# Altium schematic sheet GARY_Backplane_ModuleSlot_CurrentBuffer.SchDoc
size A3
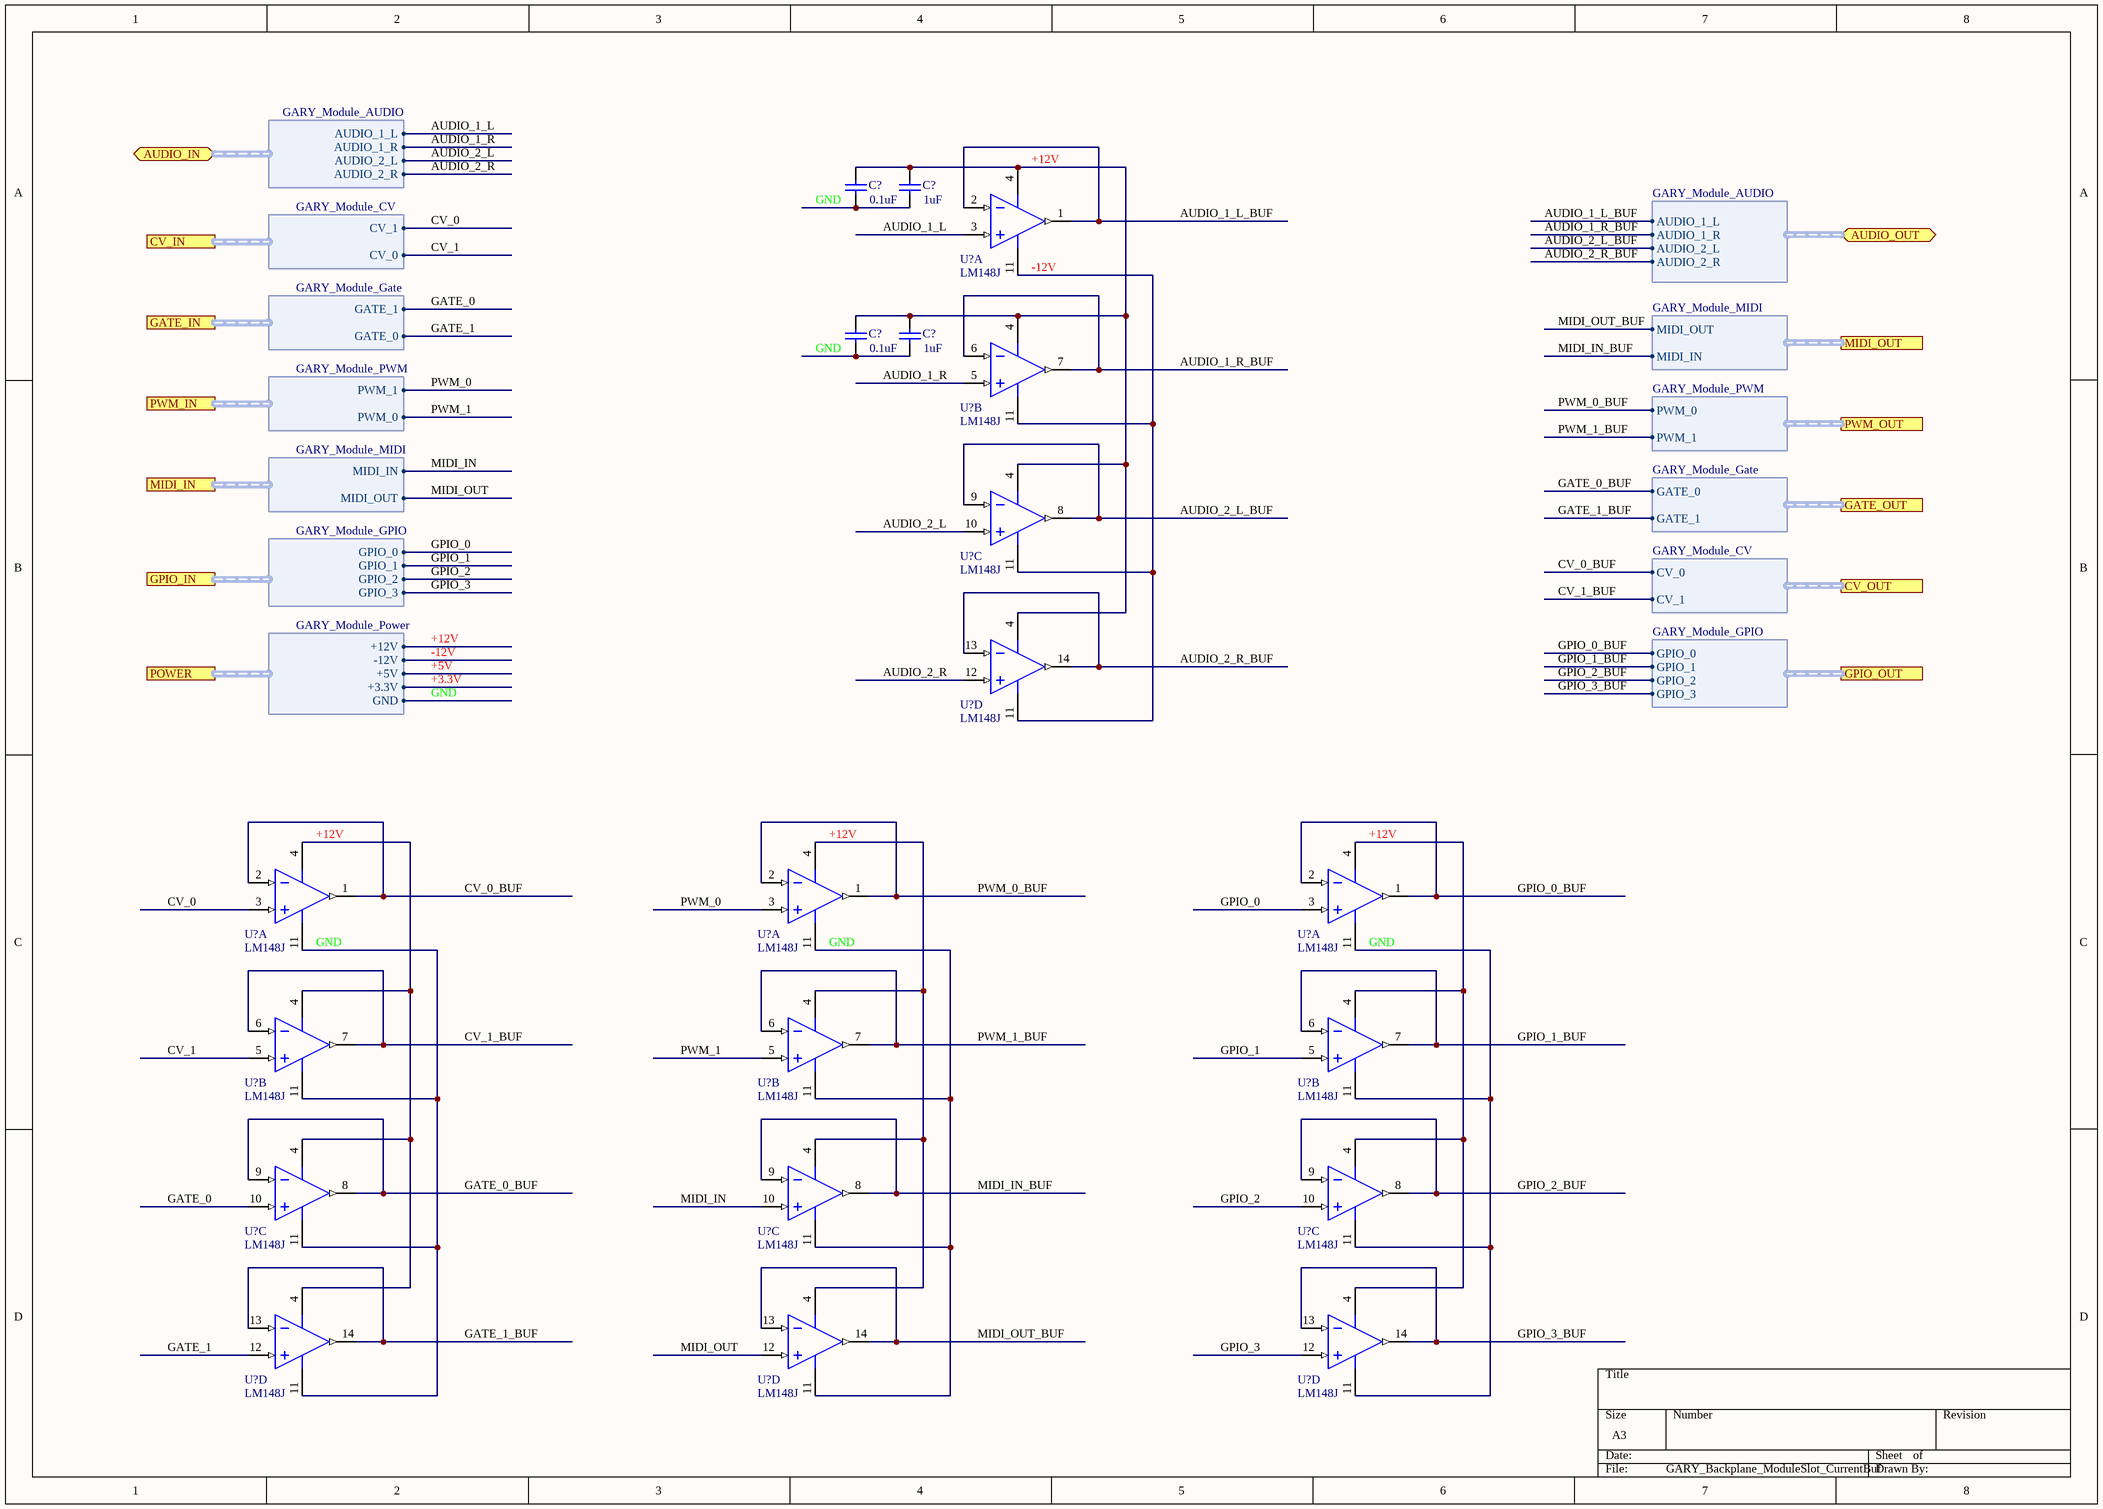
[diagram p0: GARY_Backplane_ModuleSlot_CurrentBuffer.SchDoc]

## Parts
(Parts that share a designator on the sheet are numbered #1, #2 ... from top to bottom, then left to right.)
C?#1  value 0.1uF  [RAD-0.3]  (hidden comment: Cap)
C?#2  value 1uF  [RAD-0.3]  (hidden comment: Cap)
C?#3  value 0.1uF  [RAD-0.3]  (hidden comment: Cap)
C?#4  value 1uF  [RAD-0.3]  (hidden comment: Cap)
U?#1  LM148J  [J14A]  (part A of 4)
U?#2  LM148J  [J14A]  (part B of 4)
U?#3  LM148J  [J14A]  (part C of 4)
U?#4  LM148J  [J14A]  (part D of 4)
U?#5  LM148J  [J14A]  (part A of 4)
U?#6  LM148J  [J14A]  (part A of 4)
U?#7  LM148J  [J14A]  (part A of 4)
U?#8  LM148J  [J14A]  (part B of 4)
U?#9  LM148J  [J14A]  (part B of 4)
U?#10  LM148J  [J14A]  (part B of 4)
U?#11  LM148J  [J14A]  (part C of 4)
U?#12  LM148J  [J14A]  (part C of 4)
U?#13  LM148J  [J14A]  (part C of 4)
U?#14  LM148J  [J14A]  (part D of 4)
U?#15  LM148J  [J14A]  (part D of 4)
U?#16  LM148J  [J14A]  (part D of 4)

## Ports
AUDIO_IN (harness GARY_Module_AUDIO), AUDIO_OUT (harness GARY_Module_AUDIO), CV_IN (harness GARY_Module_CV), CV_OUT (harness GARY_Module_CV), GATE_IN (harness GARY_Module_Gate), GATE_OUT (harness GARY_Module_Gate), GPIO_IN (harness GARY_Module_GPIO), GPIO_OUT (harness GARY_Module_GPIO), MIDI_IN (harness GARY_Module_MIDI), MIDI_OUT (harness GARY_Module_MIDI), POWER (harness GARY_Module_Power), PWM_IN (harness GARY_Module_PWM), PWM_OUT (harness GARY_Module_PWM)

## Harnesses
GARY_Module_Power: +12V, +5V, GND, +3.3V, -12V
GARY_Module_MIDI: MIDI_IN, MIDI_OUT
GARY_Module_GPIO: GPIO_0, GPIO_1, GPIO_2, GPIO_3
GARY_Module_PWM: PWM_0, PWM_1
GARY_Module_CV: CV_0, CV_1
GARY_Module_Gate: GATE_0, GATE_1
GARY_Module_AUDIO: AUDIO_1_L, AUDIO_1_R, AUDIO_2_R, AUDIO_2_L

## Nets
+3.3V: port POWER.+3.3V
+5V: port POWER.+5V
+12V: C?#1.2 C?#2.2 C?#3.2 C?#4.2 U?#1.4(V+) U?#2.4(V+) U?#3.4(V+) U?#4.4(V+) U?#5.4(V+) U?#6.4(V+) U?#7.4(V+) U?#8.4(V+) U?#9.4(V+) U?#10.4(V+) U?#11.4(V+) U?#12.4(V+) U?#13.4(V+) U?#14.4(V+) U?#15.4(V+) U?#16.4(V+) ; port POWER.+12V
-12V: U?#1.11(V-) U?#2.11(V-) U?#3.11(V-) U?#4.11(V-) ; port POWER.-12V
AUDIO_1_L: U?#1.3(IN1+) ; port AUDIO_IN.AUDIO_1_L
AUDIO_1_L_BUF: U?#1.1(OUT1) U?#1.2(IN1-) ; port AUDIO_OUT.AUDIO_1_L
AUDIO_1_R: U?#2.5(IN2+) ; port AUDIO_IN.AUDIO_1_R
AUDIO_1_R_BUF: U?#2.6(IN2-) U?#2.7(OUT2) ; port AUDIO_OUT.AUDIO_1_R
AUDIO_2_L: U?#3.10(IN3+) ; port AUDIO_IN.AUDIO_2_L
AUDIO_2_L_BUF: U?#3.8(OUT3) U?#3.9(IN3-) ; port AUDIO_OUT.AUDIO_2_L
AUDIO_2_R: U?#4.12(IN4+) ; port AUDIO_IN.AUDIO_2_R
AUDIO_2_R_BUF: U?#4.13(IN4-) U?#4.14(OUT4) ; port AUDIO_OUT.AUDIO_2_R
CV_0: U?#5.3(IN1+) ; port CV_IN.CV_1
CV_0_BUF: U?#5.1(OUT1) U?#5.2(IN1-) ; port CV_OUT.CV_0
CV_1: U?#8.5(IN2+) ; port CV_IN.CV_0
CV_1_BUF: U?#8.6(IN2-) U?#8.7(OUT2) ; port CV_OUT.CV_1
GATE_0: U?#11.10(IN3+) ; port GATE_IN.GATE_1
GATE_0_BUF: U?#11.8(OUT3) U?#11.9(IN3-) ; port GATE_OUT.GATE_0
GATE_1: U?#14.12(IN4+) ; port GATE_IN.GATE_0
GATE_1_BUF: U?#14.13(IN4-) U?#14.14(OUT4) ; port GATE_OUT.GATE_1
GND: C?#1.1 C?#2.1 C?#3.1 C?#4.1 U?#5.11(V-) U?#6.11(V-) U?#7.11(V-) U?#8.11(V-) U?#9.11(V-) U?#10.11(V-) U?#11.11(V-) U?#12.11(V-) U?#13.11(V-) U?#14.11(V-) U?#15.11(V-) U?#16.11(V-) ; port POWER.GND
GPIO_0: U?#7.3(IN1+) ; port GPIO_IN.GPIO_0
GPIO_0_BUF: U?#7.1(OUT1) U?#7.2(IN1-) ; port GPIO_OUT.GPIO_0
GPIO_1: U?#10.5(IN2+) ; port GPIO_IN.GPIO_1
GPIO_1_BUF: U?#10.6(IN2-) U?#10.7(OUT2) ; port GPIO_OUT.GPIO_1
GPIO_2: U?#13.10(IN3+) ; port GPIO_IN.GPIO_2
GPIO_2_BUF: U?#13.8(OUT3) U?#13.9(IN3-) ; port GPIO_OUT.GPIO_2
GPIO_3: U?#16.12(IN4+) ; port GPIO_IN.GPIO_3
GPIO_3_BUF: U?#16.13(IN4-) U?#16.14(OUT4) ; port GPIO_OUT.GPIO_3
MIDI_IN: U?#12.10(IN3+) ; port MIDI_IN.MIDI_IN
MIDI_IN_BUF: U?#12.8(OUT3) U?#12.9(IN3-) ; port MIDI_OUT.MIDI_IN
MIDI_OUT: U?#15.12(IN4+) ; port MIDI_IN.MIDI_OUT
MIDI_OUT_BUF: U?#15.13(IN4-) U?#15.14(OUT4) ; port MIDI_OUT.MIDI_OUT
PWM_0: U?#6.3(IN1+) ; port PWM_IN.PWM_1
PWM_0_BUF: U?#6.1(OUT1) U?#6.2(IN1-) ; port PWM_OUT.PWM_0
PWM_1: U?#9.5(IN2+) ; port PWM_IN.PWM_0
PWM_1_BUF: U?#9.6(IN2-) U?#9.7(OUT2) ; port PWM_OUT.PWM_1

## Library data of the parts
C?#1-C?#4 = Cap: Capacitor; Published: 8-Jun-2000; LatestRevisionDate: 17-Jul-2002; LatestRevisionNote: Re-released for DXP Platform.; PackageReference: RAD-0.3; Publisher: Altium Limited; PackageDescription: Radial Cap, Thru-Hole; 2 Leads; 0.3 in Pin Spacing
U?#1-U?#16 = LM148J: Series Quad 741 Op Amp, 14-pin CerDIP; Manufacturer: National Semiconductor; PackageTopMarking: NSUZXYYTT*LM148J; PowerWise: N; CompType: Amplifiers; High-Reliability: Y; DatasheetVersion: Nov-2003; PackageVersion: revJ, Jul-2002; PackageReference: J14A; PackageDescription: Cerdip, .400 x .310in Body, 14 Lead, .300in Centers, .100in Pitch; PartNumber: LM148J; RoHS: N; PinCount: 14; ComponentLink1Description: Manufacturer URL; ComponentLink1URL: http://www.national.com/; ComponentLink2Description: LM148 Datasheet; ComponentLink2URL: http://www.national.com/ds/LM/LM148.pdf; ComponentLink3Description: LM148 Web Page; ComponentLink3URL: http://www.national.com/pf/LM/LM148.html; ComponentLink4Description: J14A Package Page; ComponentLink4URL: http://www.national.com/packaging/folders/j14a.html